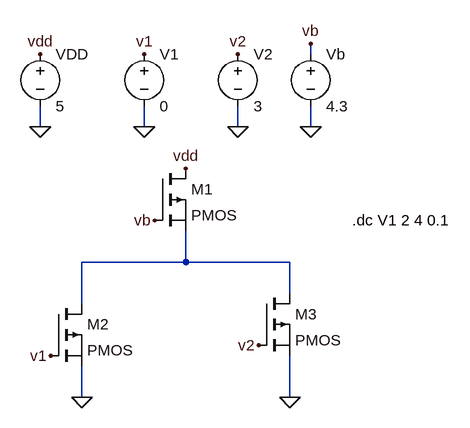
[diagram p0: schematic pmos.asc]
pmos.asc, the LTspice schematic file:
Version 4
SHEET 1 880 680
WIRE 352 -112 352 -128
WIRE -64 0 -64 -32
WIRE 96 0 96 -32
WIRE 240 0 240 -32
WIRE 352 0 352 -32
WIRE 160 208 160 160
WIRE 160 208 0 208
WIRE 320 208 160 208
WIRE 320 256 320 208
WIRE 0 272 0 208
WIRE 0 416 0 368
WIRE 320 416 320 352
FLAG -64 -112 vdd
FLAG 160 64 vdd
FLAG 96 -112 v1
FLAG -48 352 v1
FLAG 240 -112 v2
FLAG 272 336 v2
FLAG 320 416 0
FLAG 0 416 0
FLAG -64 0 0
FLAG 96 0 0
FLAG 240 0 0
FLAG 352 -128 vb
FLAG 352 0 0
FLAG 112 144 vb
SYMBOL pmos 112 64 R0
SYMATTR InstName M1
SYMBOL pmos -48 272 R0
SYMATTR InstName M2
SYMBOL pmos 272 256 R0
SYMATTR InstName M3
SYMBOL voltage -64 -128 R0
WINDOW 123 0 0 Left 2
WINDOW 39 0 0 Left 2
SYMATTR InstName VDD
SYMATTR Value 5
SYMBOL voltage 96 -128 R0
WINDOW 123 0 0 Left 2
WINDOW 39 0 0 Left 2
SYMATTR InstName V1
SYMATTR Value 0
SYMBOL voltage 240 -128 R0
WINDOW 123 0 0 Left 2
WINDOW 39 0 0 Left 2
SYMATTR InstName V2
SYMATTR Value 3
SYMBOL voltage 352 -128 R0
WINDOW 123 0 0 Left 2
WINDOW 39 0 0 Left 2
SYMATTR InstName Vb
SYMATTR Value 4.3
TEXT 416 144 Left 2 !.dc V1 2 4 0.1

The netlist it stands for:
* pmos.asc
M1 vdd vb N001 N001 PMOS
M2 N001 v1 0 0 PMOS
M3 N001 v2 0 0 PMOS
VDD vdd 0 5
V1 v1 0 0
V2 v2 0 3
Vb vb 0 4.3
.model NMOS NMOS
.model PMOS PMOS
.lib standard.mos
.dc V1 2 4 0.1
.backanno
.end

* Results of the author's LTspice run, read from the files saved beside the schematic
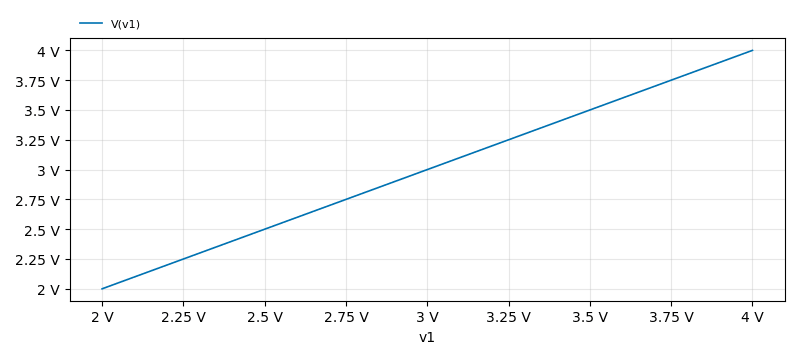
[diagram p1: DC transfer characteristic of pmos.asc, plotted from the saved traces]
* DC transfer characteristic, 1 run:
*   V(v1): 2 V at v1=2 V, 4 V at v1=4 V, min 2 V, max 4 V